# Altium schematic sheet Power_Stage.SchDoc
size A; SheetNumber: 3; SheetTotal: 4
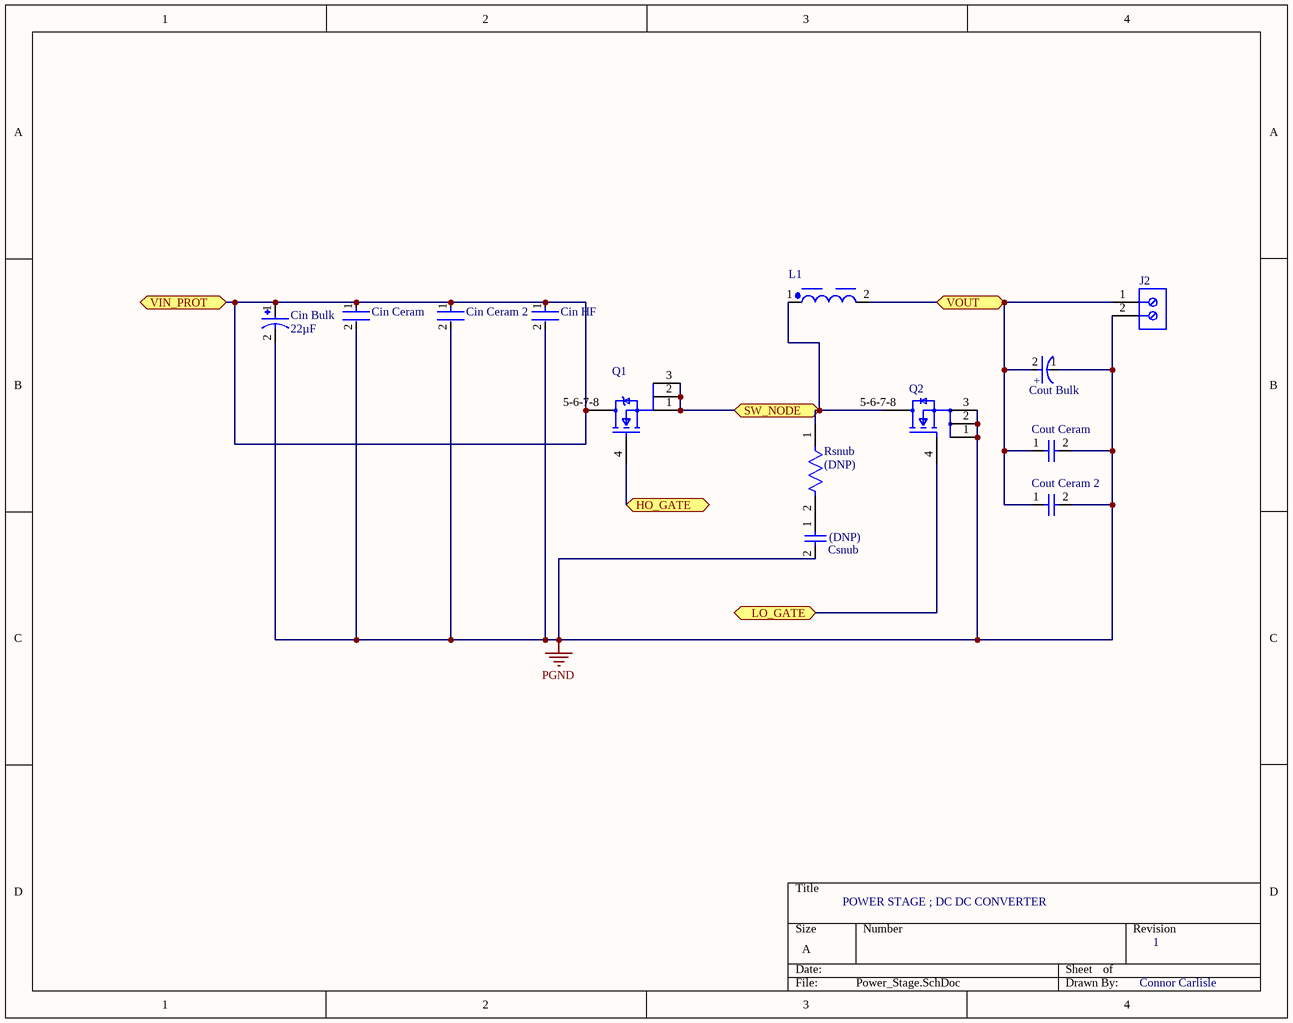
[diagram p0: Power_Stage.SchDoc]

## Parts
Cin_Bulk  value 22µF  [CAP_EEHZA1H220V]  (hidden comment: EEHZA1H220V)
Cin_Ceram  GRM32ER71H475KA88L  [FP-GRM32-MFG]  (value not drawn)
Cin_Ceram_2  GRM32ER71H475KA88L  [FP-GRM32-MFG]  (value not drawn)
Cin_HF  GRM188R72A104KA35D  [FP-GRM188-0_1-e0_2_0_5-IPC_B]  (value not drawn)
Cout_Bulk  16SVPG47M  [FP-OS-CON-SMT-B45-MFG]  (value not drawn)
Cout_Ceram  GRM32ER71C226KE18L  [CAPC3225X270X30LL30]  (value not drawn)
Cout_Ceram_2  GRM32ER71C226KE18L  [CAPC3225X270X30LL30]  (value not drawn)
Csnub  (DNP)  [CAPC1608X90X35NL10T15]
J2  691210910002  [691210910002]  (value not drawn)
L1  74437349100  [WE-LHMI_7050]  (value not drawn)
Q1  CSD18563Q5A  [FP-DQJ0008A-MFG]  (value not drawn)
Q2  CSD18531Q5AT  [FP-DQJ0008A-MFG]  (value not drawn)
Rsnub  (DNP)  [FP-RC0603-0_55-IPC_A]

## Ports
HO_GATE (bidir, see Top[3C], Controller[3B]), LO_GATE (bidir, see Top[3C], Controller[3B]), SW_NODE (bidir, see Top[3C], Controller[1C], Controller[3B], Controller[4C]), VIN_PROT (bidir, see Top[3B], Controller[1A], Controller[1C], Controller[4C], Input_Protection[3B]), VOUT (bidir, see Top[3C], Controller[1B], Controller[2C], Controller[4C])

## Nets
PGND: Cin_Bulk.2 Cin_Ceram.2 Cin_Ceram_2.2 Cin_HF.2 Cout_Bulk.1(C) Cout_Ceram.2 Cout_Ceram_2.2 Csnub.2 J2.2 Q2.1(S) Q2.2(S) Q2.3(S)
HO_GATE: Q1.4(G) ; port HO_GATE
LO_GATE: Q2.4(G) ; port LO_GATE
SW_NODE: L1.1 Q1.1(S) Q1.2(S) Q1.3(S) Q2.5-6-7-8(D) Rsnub.1 ; port SW_NODE
VIN_PROT: Cin_Bulk.1 Cin_Ceram.1 Cin_Ceram_2.1 Cin_HF.1 Q1.5-6-7-8(D) ; port VIN_PROT
VOUT: Cout_Bulk.2(A) Cout_Ceram.1 Cout_Ceram_2.1 J2.1 L1.2 ; port VOUT
NetCsnub_1: Csnub.1 Rsnub.2

## Notes on the sheet
- POWER STAGE ; DC DC CONVERTER
- 1
- Connor Carlisle
- (in symbol CMP-05428-000223-1) +

## Library data of the parts
Cin_Bulk = CMP-001-00083-1: Cap Aluminum Polymer Hybrid 22uF 50VDC 20% (6.3 X 6.1mm) SMD 0.08 Ohm 1100mA 10000h 105C Automotive T/R; MF: Panasonic; Pins: 2; MP: EEHZA1H220V; Component Type: Standard; Source: EEHZA1H220V.SchLib; SnapEDA_Link: https://www.snapeda.com/parts/EEHZA1H220V/Panasonic/view-part/?ref=snap; Design Item ID: EEHZA1H220V; Case/Package: RADIAL-2 Panasonic; Check_prices: https://www.snapeda.com/parts/EEHZA1H220V/Panasonic/view-part/?ref=eda
Cin_Ceram Cin_Ceram_2 = CMP-1038-02162-3: CAP CER 4.7UF 50V X7R 1210; Manufacturer: Murata; Tolerance: 10%; Temperature Coefficient: 15%; Lead Free: Yes; Value: 4.7uF; ComponentLink2Description: Datasheet; Capacitance: 4.7uF; Digikey Description: CAP CER 4.7UF 50V X7R 1210; Category: Cap; Automotive: No; ComponentLink2URL: https://search.murata.co.jp/Ceramy/image/img/A01X/G101/ENG/GRM32ER71H475KA88-01A.pdf; Package: GRM32; Device Class L2: Capacitors; Voltage Rating: 50V; Device Class L1: Passive Components; Mouser Description: Capacitor Capacitance tolerance: ±10% Ceramic type: X7R Construction form: 1210 Capacitance: 4.7 µF Rated voltage: 50...; Octopart: https://octopart.com/grm32er71h475ka88l-murata-196576; Temperature: -55°C to +125°C; Temperature Range Low: -55°C; Height: 2.7mm; Manufacturer Part Number: GRM32ER71H475KA88L; Temperature Characteristic: X7R; Temperature Range High: +125°C; RoHS: TRUE; Material: Ceramic; Device Class L3: Ceramic Capacitors
Cin_HF = CMP-1035-02595-8: Chip Multilayer Ceramic Capacitors for General Purpose, 0603, 0.10uF, X7R, 15%, 10%, 100V; Capacitance: 100nF; Voltage Rating (DC): 100V; Material: Ceramic; Packaging: Tape and Reel; Dielectric: X7R; Case Code (Imperial): 0603; Package Quantity: 1; Height: 0.8mm; Weight: 0.000222oz; Min Operating Temperature: -55°C; Depth: 0.8mm; Mount: Surface Mount; Thickness: 0.035inch; Voltage: 100V; REACH SVHC: No SVHC; Case/Package: 0603; Voltage Rating: 100V; Width: 0.8mm; Tolerance: 10%; Lead Free: Lead Free; Case Code (Metric): 1608; Radiation Hardening: No; Max Operating Temperature: 125°C; Termination: SMD/SMT; Length: 1.6mm
Cout_Bulk = CMP-05428-000223-1: CAP ALUM POLY 47UF 20% 16V SMD; Polarity: Polar; ESR (Equivalent Series Resistance): 25mR; Ripple Current: 3.2A; Life (Hours): 5000Hour; RoHS Compliant: Yes; Capacitance: 47uF; Case/Package: Radial; Voltage Rating: 16V; Max Operating Temperature: 105°C; Tolerance: 20%; Voltage Rating (DC): 16V; Mount: Surface Mount; Series: OS-CON™, SVPG; Min Operating Temperature: -55°C; Height - Seated (Max): 0.177inch; Package Quantity: 2500; REACH SVHC: No SVHC; Packaging: Cut Tape
Cout_Ceram Cout_Ceram_2 = CMP-2000-06364-1: Chip Capacitor, 22 uF, +/- 10%, 16 V, -55 to 125 degC, 1210 (3225 Metric), RoHS, Tape and Reel; Manufacturer: Murata; Rated Voltage: 16V; Dielectric: X7R; Capacitance: 22000000pF; Case Size/Dimension: 1210; Datasheet Version: 11/2010; Mounting Technology: SurfaceMount; Package Description: 2-Pin Surface Mount Device, Body 3.2 x 2.5 mm; Manufacturer URL: http://www.murata.com/; Datasheet URL: http://media.digikey.com/pdf/Data%20Sheets/Murata%20PDFs/grm32er71c226ke18.pdf; Package Reference: 1210; Tolerance (%): ±10%
Csnub = CMP-2006-02891-1: Part Number: GRM188R71H102KA01D; Manufacturer: Murata
J2 = CMP-1502-02456-3: Tb, Wire To Brd, R/A, 2Way, 18Awg Rohs Compliant: Yes; Voltage Rating: 150V; Number of Contacts: 2; Current Rating: 6A; RoHS: Compliant; Number of Rows: 1; Max Operating Temperature: 105°C; Height: 8.7mm; Contact Material: Tin; Min Operating Temperature: -40°C
L1 = CMP-1353-00074-7: General Purpose Inductor, 10uH, 20%, 1 Element, Powdered Iron-Core, SMD, 2926; Current Rating: 3.2A; Inductance: 10µH; Test Frequency: 100kHz; Frequency: 12MHz; Saturation Current: 5.6A; DC Resistance (DCR): 65mΩ; Core Material: Composite, Ferrite; Shielding: Shielded; Series Resistance: 69mΩ; Ambient Temperature Range Low: -40°C; Width: 6.6mm; REACH SVHC: Unknown; Height: 4.8mm; Termination: SMD/SMT; Depth: 6.6mm; Composition: Wirewound; Inductance Tolerance: 20%; RoHS: Compliant; Tolerance: 20%; Max DC Current: 3.2A; Height - Seated (Max): 5.0038mm; Length: 7.3mm; Ambient Temperature Range High: 85°C; Min Operating Temperature: -40°C; Mount: Surface Mount; Case/Package: Nonstandard; Lead Free: Lead Free; Max Operating Temperature: 125°C; Self Resonant Frequency: 12MHz; RMS Current (Irms): 3.2A
Q1 = CMP-04962-000004-1: MOSFET N-CH 60V 100A 8SON; Manufacturer: Texas Instruments; Threshold Vgs Max: 2.4V; Number Of Channels: 1; Input Capacitace At Vds: 1150pF @ 30V; Gate Charge At Vgs: 15nC @ 10V; Reverse Recovery Charge: 63nC; Max Junction Temp: +150°C; Max Forward Diode Voltage: 1V; Power Dissipation: 3.2W; Reverse Recovery Time: 49ns; Rthja Max: 50°C/W; Typ Forward Diode Voltage: 0.8V; Turn On Delay Time: 3.2ns; Threshold Vgs Min: 1.7V; Drain To Source Resistance: 5.7mΩ; Turn Off Delay Time: 11.4ns; Transconductance: 60S; Gate To Source Voltage: 20V; Continuous Drain Current: 15A; Package: DQJ0008A; Temperature Range High: +150°C; Device Class L3: MOSFETs; Device Class L2: Transistors; Manufacturer Part Number: CSD18563Q5A; RoHS: TRUE; Number Of N Channels: 1; Automotive: No; Lead Free: Yes; Digikey Description: MOSFET N-CH 60V 100A 8SON; Drain To Source Breakdown Voltage: 60V; Temperature Range Low: -55°C; Temperature: -55°C to +150°C; Category: Trans; Device Class L1: Discrete Semiconductors; Height: 1.1mm; Octopart: https://octopart.com/csd18563q5a-texas+instruments-30331677; ComponentLink2Description: Datasheet; ComponentLink2URL: http://www.ti.com/lit/ds/symlink/csd18563q5a.pdf; Drain To Source Voltage: 60V; Mouser Description: MOSFET 60V N-Channel NexFET Power MOSFET
Q2 = CMP-04962-000084-1: MOSFET N-CH 60V 100A 8VSON; Turn-On Delay Time: 4.4ns; Gate to Source Voltage (Vgs): 20V; Input Capacitance: 3.84nF; Rds On Max: 4.6mR; Element Configuration: Single; Turn-Off Delay Time: 20ns; Fall Time: 2.7ns; Rise Time: 7.8ns; Max Power Dissipation: 3.1W; Resistance: 0.0035R; Continuous Drain Current (ID): 100A; Mount: Surface Mount; Packaging: Tape and Reel; Number of Pins: 8; Contact Plating: Tin; RoHS Compliant: Yes; Min Operating Temperature: -55°C; Max Operating Temperature: 150°C; Drain to Source Voltage (Vdss): 60V; Lead Free: Contains Lead
Rsnub = CMP-03412-037810-1: RES SMD 2.2 OHM 1% 1/10W 0603; Voltage Rating: 50V; Max Power Dissipation: 100mW; Resistance: 2.2R; Temperature Coefficient: 200ppm/°C; Lead Free: Lead Free; Series: RC; Resistor Type: Thick Film; Case Code (Imperial): 0603; Number of Pins: 2; Min Operating Temperature: -55°C; Packaging: Tape and Reel; Length: 0.063inch; Power Rating: 100mW; Features: Moisture Resistant; Resistance Tolerance: 1%; Termination: SMD/SMT; Width: 0.031inch; REACH SVHC: No SVHC; Case Code (Metric): 1608; Height: 0.022inch; Voltage Rating (DC): 50V; Size Code: 0603; Max Operating Temperature: 155°C; Case/Package: 0603; Number of Terminations: 2; Depth: 0.8mm; Tolerance: 1%; RoHS Compliant: Yes; Technology: THICK FILM; Package Quantity: 1